# EAGLE board HTH-2019-Badge-PROD-RC1 (EAGLE 9.3.2), part 1 of 2
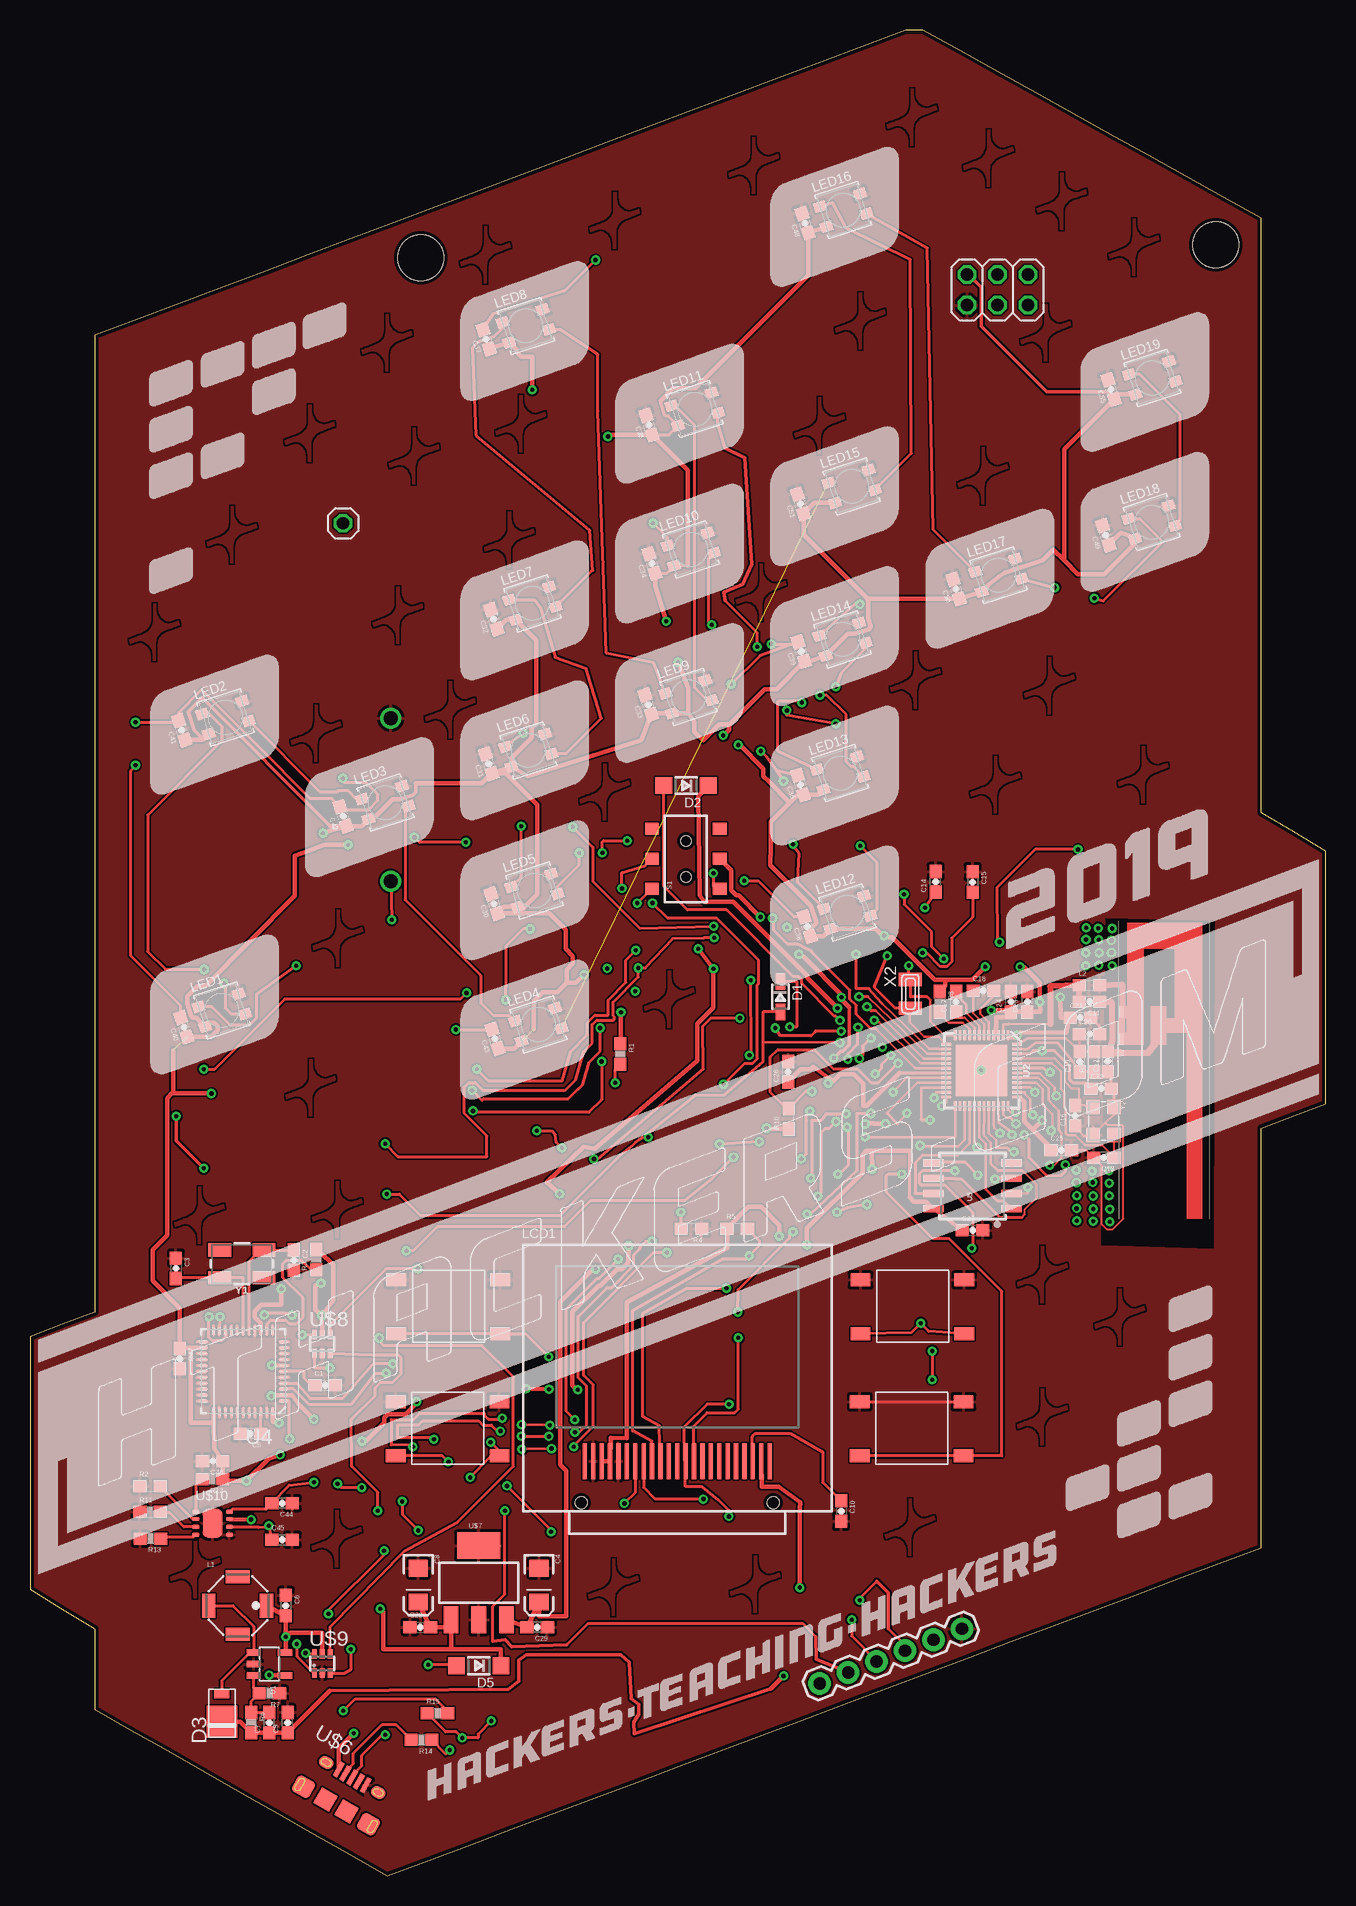
[diagram p2: board, top side]
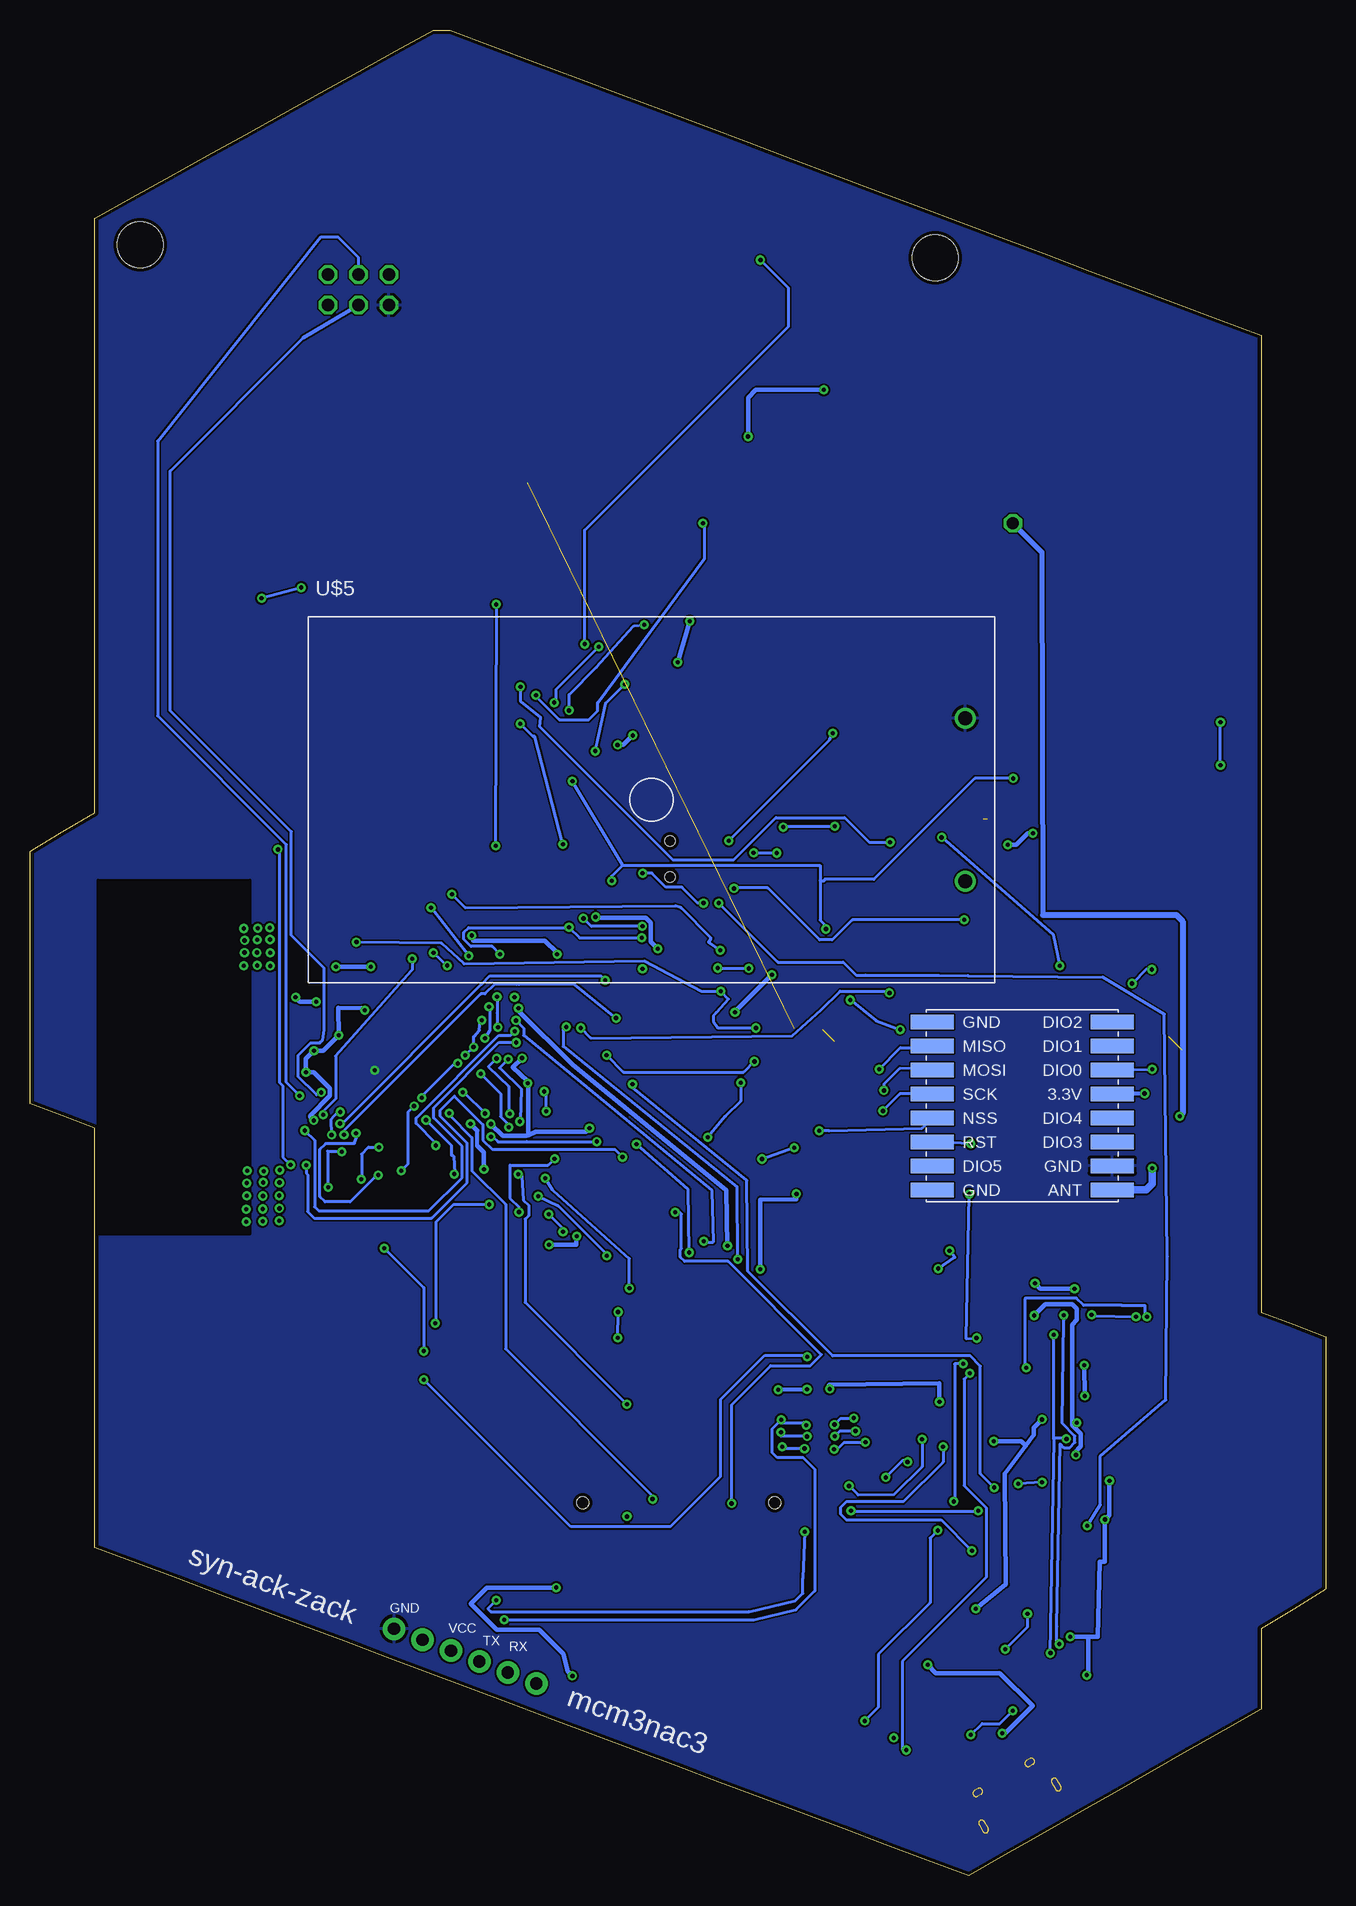
[diagram p3: board, bottom side, seen from below]

Size 108 x 153.82 mm. Coordinates in mm from the lower left corner, seen from the top.
Outline: 108,85.39 105.29,87 102.59,88.6 102.59,138.13 99.46,139.87 96.32,141.62 93.19,143.36 90.06,145.1 86.93,146.85 83.8,148.59 80.66,150.33 77.53,152.07 74.4,153.82 72.99,153.82 69.43,152.48 65.88,151.14 62.32,149.8 58.76,148.46 55.2,147.12 51.65,145.78 48.09,144.44 44.53,143.1 40.98,141.76 37.42,140.43 33.86,139.09 30.31,137.75 26.75,136.41 23.19,135.07 19.64,133.73 16.08,132.39 12.52,131.05 8.97,129.71 5.41,128.37 5.41,46.98 2.7,45.95 0,44.92 0,23.88 2.7,22.23 5.41,20.59 5.41,13.88 8.46,12.14 11.5,10.41 14.55,8.67 17.6,6.94 20.65,5.2 23.69,3.47 26.74,1.73 29.79,0 33.26,1.3 36.72,2.6 40.19,3.91 43.66,5.21 47.12,6.51 50.59,7.81 54.06,9.11 57.52,10.41 60.99,11.72 64.46,13.02 67.92,14.32 71.39,15.62 74.86,16.92 78.32,18.23 81.79,19.53 85.26,20.83 88.72,22.13 92.19,23.43 95.66,24.73 99.12,26.04 102.59,27.34 102.59,62.29 105.29,63.32 108,64.35 108,85.39
Copper layers (1*16): Top 0.035mm / dielectric 1.5mm / Bottom 0.035mm
Design rules "default *": minimum track width 6mil, minimum drill 0.35mm, track to track 6mil, track to pad 6mil, pad to pad 6mil, via to via 6mil, smd to smd 6mil, copper to edge 12mil, drill to drill 8mil, minimum pad ring 10mil, minimum via ring 8mil, stop-mask expansion 4mil, vias tented up to drill 14mil, thermal gap 10mil
Holes 3.81 mm at 98.8,135.92 32.57,134.85

## Footprints (pad centres in the part's own frame; a part is rotated, then mirrored left to right if it is on the bottom)
CAP0603 = smd 1.1 x 1: 1 -0.85,0; 2 0.85,0
EIA3216 = smd 1.4 x 1.6: A 1.4,0; C -1.4,0
SOD-323 = smd 1.35 x 0.8: A 1.27,0; C -1.27,0
SOD-123 = smd 1.4 x 1.4: A 1.85,0; C -1.85,0
DO220AAL = smd 2.667 x 2.54: P$1 -0.7,0 | smd 0.762 x 1.27: P$2 1.65,0
TRACE_ANTENNA_2.4GHZ_25.7MM_TUNED = smd 0.46 x 0.46: ANT 0,0.23 | smd 1 x 0.46: GND -1.18,0.23; GND2 -3.38,0.23
1X06 = drill 1.016 pad 1.88: 1 0,0; 2 2.54,0; 3 5.08,0; 4 7.62,0; 5 10.16,0; 6 12.7,0
1X01 = drill 1.016 octagon: 1 0,0
2X03 = drill 1.016 octagon: 1 -2.54,-1.27; 2 -2.54,1.27; 3 0,-1.27; 4 0,1.27; 5 2.54,-1.27; 6 2.54,1.27
SRU5028 = smd 1.1 x 2: 1 2.4,0; 2 -2.4,0 | smd 2 x 1.1: P$1 0,2.4; P$2 0,-2.4
0603 = smd 1.1 x 1: 1 -0.85,0; 2 0.85,0
UG-9664HDDAG01_WRAPAROUND = smd 0.35 x 3: 1 -7.7,4.138; 2 -7,4.138; 3 -6.3,4.138; 4 -5.6,4.138; 5 -4.9,4.138; 6 -4.2,4.138; 7 -3.5,4.138; 8 -2.8,4.138; 9 -2.1,4.138; 10 -1.4,4.138; 11 -0.7,4.138; 12 0,4.138; 13 0.7,4.138; 14 1.4,4.138; 15 2.1,4.138; 16 2.8,4.138; 17 3.5,4.138; 18 4.2,4.138; 19 4.9,4.138; 20 5.6,4.138; 21 6.3,4.138; 22 7,4.138; 23 7.7,4.138 | hole 1: -8,0.688; 8,0.688
LED3535 = smd 1 x 0.85: 1 -1.75,0.875; 2 -1.75,-0.875; 3 1.75,-0.875; 4 1.75,0.875
RES-0603 = smd 1.1 x 1: 1 -0.85,0; 2 0.85,0
AYZ0202 = smd 1 x 1.15: 1 -2.5,2.825; 2 0,2.825; 3 2.5,2.825; 4 -2.5,-2.825; 5 0,-2.825; 6 2.5,-2.825 | hole 0.85: 1.5,0; -1.5,0
SOT23-5 = smd 0.55 x 1.2: 1 -0.95,-1.3; 2 0,-1.3; 3 0.95,-1.3; 4 0.95,1.3; 5 -0.95,1.3
QFN48-0.4MM = smd 0.8 x 0.23: 1 -2.95,2.2; 2 -2.95,1.8; 3 -2.95,1.4; 4 -2.95,1; 5 -2.95,0.6; 6 -2.95,0.2; 7 -2.95,-0.2; 8 -2.95,-0.6; 9 -2.95,-1; 10 -2.95,-1.4; 11 -2.95,-1.8; 12 -2.95,-2.2; 25 2.95,-2.2; 26 2.95,-1.8; 27 2.95,-1.4; 28 2.95,-1; 29 2.95,-0.6; 30 2.95,-0.2; 31 2.95,0.2; 32 2.95,0.6; 33 2.95,1; 34 2.95,1.4; 35 2.95,1.8; 36 2.95,2.2 | smd 0.23 x 0.8: 13 -2.2,-2.95; 14 -1.8,-2.95; 15 -1.4,-2.95; 16 -1,-2.95; 17 -0.6,-2.95; 18 -0.2,-2.95; 19 0.2,-2.95; 20 0.6,-2.95; 21 1,-2.95; 22 1.4,-2.95; 23 1.8,-2.95; 24 2.2,-2.95; 37 2.2,2.95; 38 1.8,2.95; 39 1.4,2.95; 40 1,2.95; 41 0.6,2.95; 42 0.2,2.95; 43 -0.2,2.95; 44 -0.6,2.95; 45 -1,2.95; 46 -1.4,2.95; 47 -1.8,2.95; 48 -2.2,2.95 | smd 4.3 x 4.3: EP 0,0
QFN-44-NOPAD_1:1-OUTFAKES = smd 0.8 x 0.3: 1 -3.337,2.465; 2 -3.337,1.972; 3 -3.337,1.479; 4 -3.337,0.986; 5 -3.337,0.493; 6 -3.337,0; 7 -3.337,-0.493; 8 -3.337,-0.986; 9 -3.337,-1.479; 10 -3.337,-1.972; 11 -3.337,-2.465; 23 3.337,-2.465; 24 3.337,-1.972; 25 3.337,-1.479; 26 3.337,-0.986; 27 3.337,-0.493; 28 3.337,0; 29 3.337,0.493; 30 3.337,0.986; 31 3.337,1.479; 32 3.337,1.972; 33 3.337,2.465 | smd 0.3 x 0.8: 12 -2.465,-3.337; 13 -1.972,-3.337; 14 -1.479,-3.337; 15 -0.986,-3.337; 16 -0.493,-3.337; 17 0,-3.337; 18 0.493,-3.337; 19 0.986,-3.337; 20 1.479,-3.337; 21 1.972,-3.337; 22 2.465,-3.337; 34 2.465,3.337; 35 1.972,3.337; 36 1.479,3.337; 37 0.986,3.337; 38 0.493,3.337; 39 0,3.337; 40 -0.493,3.337; 41 -0.986,3.337; 42 -1.479,3.337; 43 -1.972,3.337; 44 -2.465,3.337
SOIC-8 = smd 0.61 x 1.702: 1 -1.905,-3.251; 2 -0.635,-3.251; 3 0.635,-3.251; 4 1.905,-3.251; 5 1.905,3.251; 6 0.635,3.251; 7 -0.635,3.251; 8 -1.905,3.251
BUTTON = smd 1.65 x 1.1: 1 -4.325,2.25; 2 4.325,2.25; 3 -4.325,-2.25; 4 4.325,-2.25
AA = drill 1.17: + 26.16,-6.795; - 26.16,6.795
USB-MICRO-TH-SUPPORT = smd 0.4 x 1.35: 1 -1.3,2.7; 2 -0.65,2.7; 3 0,2.7; 4 0.65,2.7; 5 1.3,2.7 | smd 1.25 x 0.95: P$1 2.5,2.7; P$2 -2.5,2.7 | smd 1.5 x 1.5: P$3 -1,0; P$4 1,0 | smd 1.645 x 1.55: P$5 3.123,0; P$6 -3.123,0
SOT223 = smd 1.219 x 2.235: 1 -2.311,-3.099; 2 0,-3.099; 3 2.311,-3.099 | smd 3.6 x 2.2: 4 0,3.099
SOT-363 = smd 0.4 x 0.8: 1 -0.65,-0.8; 2 0,-0.8; 3 0.65,-0.8; 4 0.65,0.8; 5 0,0.8; 6 -0.65,0.8
8-VDFN = smd 0.6 x 0.3: 1 -1.4,0.95; 2 -1.4,0.35; 3 -1.4,-0.3; 4 -1.4,-0.95; 5 1.4,-0.95; 6 1.4,-0.3; 7 1.4,0.35; 8 1.4,0.95 | smd 1.65 x 2.4: 9 0,0
WIRELESS-LORA-RFM95W#SMD = smd 3.6 x 1.2: A1 -7.5,7; A2 -7.5,5; A3 -7.5,3; A4 -7.5,1; A5 -7.5,-1; A6 -7.5,-3; A7 -7.5,-5; A8 -7.5,-7; B1 7.5,7; B2 7.5,5; B3 7.5,3; B4 7.5,1; B5 7.5,-1; B6 7.5,-3; B7 7.5,-5; B8 7.5,-7
XTAL3215 = smd 1.1 x 1.9: P$1 1.2,0; P$2 -1.2,0
CRYSTAL-SMD-5X3.2-4PAD = smd 1.9 x 1.1: 1 -1.85,-1.15; 2 1.85,-1.15; 3 1.85,1.15; 4 -1.85,1.15
CRYSTAL-SMD-3.2X2.5 = smd 1.2 x 1.1: 1 -1.175,-0.875; 2 1.175,-0.875; 3 1.175,0.875; 4 -1.175,0.875

## Placement (x,y rotation side)
C1  1uF  [CAP0603]  24.59,40.88 0 top
C2  22pF  [CAP0603]  21.99,51.3 270 top
C3  22pF  [CAP0603]  12.16,50.62 270 top
C4  10uF  [EIA3216]  42.42,24.22 270 top
C5  0.1uF  [CAP0603]  18.37,36.85 180 top
C6  10uF  [CAP0603]  21.32,22.52 270 top
C7  0.1uF  [CAP0603]  19.95,12.77 90 top
C8  10uF  [EIA3216]  32.37,24.22 270 top
C9  10uF  [CAP0603]  21.47,12.77 90 top
C10  10uF  [CAP0603]  67.6,30.39 270 top
C11  5.6pF  [CAP0603]  88.3,72.84 180 top
C12  2.4pF  [CAP0603]  89.82,67.86 90 top
C13  10pF  [CAP0603]  89.49,59.86 180 top
C14  15pF  [CAP0603]  75.47,82.84 90 top
C15  15pF  [CAP0603]  78.54,82.81 270 top
C16  10pF  [CAP0603]  87.09,63.35 90 top
C17  270pF  [CAP0603]  77.17,72.84 90 top
C18  270pF  [CAP0603]  79.46,73.75 0 top
C19  3nF  [CAP0603]  87.49,67.84 90 top
C20  10nF  [CAP0603]  88.3,70.14 0 top
C21  0.1uF  [CAP0603]  87.54,71.52 0 top
C22  100pF  [CAP0603]  89.27,65.6 0 top
C23  0.1uF  [CAP0603]  83.12,72.84 90 top
C24  10uF  [CAP0603]  81.74,72.84 90 top
C25  0.1uF  [CAP0603]  85.93,60.47 0 top
C26  0.1uF  [CAP0603]  63.17,67.01 90 top
C27  0.1uF  [CAP0603]  78.54,53.79 0 top
C28  0.1uF  [CAP0603]  32.52,20.72 0 top
C29  1uF  [CAP0603]  42.27,20.72 180 top
C30  0.1uF  [CAP0603]  38.68,81 108 top
C31  0.1uF  [CAP0603]  38.23,92.67 108 top
C32  0.1uF  [CAP0603]  38.65,104.71 108 top
C33  0.1uF  [CAP0603]  51.52,97.59 108 top
C34  0.1uF  [CAP0603]  51.83,109.35 108 top
C35  0.1uF  [CAP0603]  51.59,120.89 108 top
C36  0.1uF  [CAP0603]  64.21,90.89 108 top
C37  0.1uF  [CAP0603]  38.01,128.05 108 top
C38  0.1uF  [CAP0603]  64.76,79.1 108 top
C39  0.1uF  [CAP0603]  64.27,102.02 108 top
C40  0.1uF  [CAP0603]  12.82,70.72 108 top
C41  0.1uF  [CAP0603]  12.64,95.46 108 top
C42  0.1uF  [CAP0603]  26.1,88.29 108 top
C43  0.1uF  [CAP0603]  38.76,69.74 108 top
C44  1uF  [CAP0603]  21.01,31.05 180 top
C45  1uF  [CAP0603]  21.01,28.01 0 top
C46  4.7uF  [CAP0603]  15.22,34.56 180 top
C47  1uF  [CAP0603]  12.48,43.09 270 top
C48  0.1uF  [CAP0603]  64.59,137.72 108 top
C49  0.1uF  [CAP0603]  89.64,111.72 108 top
C50  0.1uF  [CAP0603]  77.18,107.23 108 top
C51  0.1uF  [CAP0603]  64.2,114.31 108 top
C55  0.1uF  [CAP0603]  90.1,123.86 108 top
D1  1N4148  [SOD-323]  62.53,73.26 270 top
D2  MBR120  [SOD-123]  54.67,90.86 180 top
D3  SS1P3L  [DO220AAL]  15.98,13.53 90 top
D5  MBR120  [SOD-123]  37.4,17.52 180 top
E1  ANTENNA  [TRACE_ANTENNA_2.4GHZ_25.7MM_TUNED]  90.74,68.57 270 top
FTDI  FTDI Basic  [1X06]  65.81,16.03 21 top
JP1  [1X01]  26.09,112.71 0 top
JP2  [2X03]  80.62,132.17 0 top
L1  10uH/1.8A  [SRU5028]  17.3,22.52 0 top
L2  2.7nH  [0603]  88.3,74.21 0 top
LCD1  UG-9664HDDAG01  [UG-9664HDDAG01_WRAPAROUND]  53.94,30.4 0 top
LED1  WS2812B3535  [LED3535]  15.99,72.12 18 top
LED2  WS2812B3535  [LED3535]  16.29,96.53 18 top
LED3  WS2812B3535  [LED3535]  29.61,89.43 18 top
LED4  WS2812B3535  [LED3535]  42.36,70.94 18 top
LED5  WS2812B3535  [LED3535]  42.04,82.11 18 top
LED6  WS2812B3535  [LED3535]  41.53,93.78 18 top
LED7  WS2812B3535  [LED3535]  41.87,106.04 18 top
LED8  WS2812B3535  [LED3535]  41.32,129.16 18 top
LED9  WS2812B3535  [LED3535]  54.88,98.25 18 top
LED10  WS2812B3535  [LED3535]  55.07,110.54 18 top
LED11  WS2812B3535  [LED3535]  55.4,122.21 18 top
LED12  WS2812B3535  [LED3535]  68.11,80.28 18 top
LED13  WS2812B3535  [LED3535]  67.52,91.89 18 top
LED14  WS2812B3535  [LED3535]  67.71,103.04 18 top
LED15  WS2812B3535  [LED3535]  68.47,115.79 18 top
LED16  WS2812B3535  [LED3535]  67.77,138.81 18 top
LED17  WS2812B3535  [LED3535]  80.7,108.38 18 top
LED18  WS2812B3535  [LED3535]  93.48,112.8 18 top
LED19  WS2812B3535  [LED3535]  93.53,124.82 18 top
R1  10k  [RES-0603]  49.19,68.49 270 top
R2  100k  [RES-0603]  10.01,32.48 0 top
R3  10k  [RES-0603]  23.86,51.34 90 top
R4  920k  [RES-0603]  55.12,53.91 180 top
R5  10k  [RES-0603]  58.93,53.94 0 top
R6  100K  [RES-0603]  18.42,12.77 270 top
R7  10K  [RES-0603]  19.95,15.2 180 top
R8  10k  [RES-0603]  75.8,72.84 270 top
R9  20k  [RES-0603]  88.67,67.83 90 top
R10  10k  [RES-0603]  63.22,63.09 90 top
R11  20k  [RES-0603]  10.01,30.32 0 top
R12  100k  [RES-0603]  15.22,33.04 180 top
R13  1k  [RES-0603]  10.04,28.11 180 top
R14  22  [RES-0603]  32.63,11.32 180 top
R15  22  [RES-0603]  33.95,13.53 0 top
S1  SWITCH-DPDTSMD  [AYZ0202]  54.66,84.74 90 top
U1  FAN5331SX  [SOT23-5]  19.95,17.64 270 top
U2  ESP3212  [QFN48-0.4MM]  79.31,67.1 270 top
U4  ATMEGA32U4  [QFN-44-NOPAD_1:1-OUTFAKES]  17.76,42.03 180 top
U5  W25Q32FVSS  [SOIC-8]  78.54,57.5 90 top
U$1  BUTTON  [BUTTON]  34.79,37.25 0 top
U$2  BUTTON  [BUTTON]  34.85,47.42 0 top
U$3  BUTTON  [BUTTON]  73.54,47.41 0 top
U$4  BUTTON  [BUTTON]  73.47,37.25 0 top
U$5  BAT_HOLD  [AA]  56.21,89.67 0 bottom
U$6  USB_SENSE  [USB-MICRO-TH-SUPPORT]  25.5,5.86 330 top
U$7  V_REG_MIC2920  [SOT223]  37.4,24.42 0 top
U$8  74LVC1G3157GW,125  [SOT-363]  24.37,44.31 0 top
U$9  74LVC1G3157GW,125  [SOT-363]  24.37,17.69 0 top
U$10  TPS2113ADRBR3X3MM  [8-VDFN]  15.22,29.38 0 top
U$11  WIRELESS-LORA-RFM95W#SMD  [WIRELESS-LORA-RFM95W#SMD]  25.31,64.15 0 bottom
X2  32.768  [XTAL3215]  73.36,73.5 270 top
Y1  8MHz  [CRYSTAL-SMD-5X3.2-4PAD]  17.65,51 180 top
Y2  26MHz  [CRYSTAL-SMD-3.2X2.5]  89.47,62.9 270 top

## Tracks (layer width: path | path; a pad name or v marks a point on that pad's centre or on a via)
3V3  (via drill 0.35)
  Top 0.356: U$7.3 C29.2 C4.A 42.42,21.64 44.68,21.64 44.68,33.77 44.19,34.27 44.19,47.84 46.89,50.54 v47.14,50.54 | S1.5 58.44,83.78 58.44,82.12 58.85,81.7 59.06,81.7 v60.87,79.9 | v55.68,77.25 v56.96,75.58 56.96,72.34 55.61,71 55.61,70.99 55.61,70.98 55.61,70.8 55.61,67.92 47.06,60.58 46.16,60.74 43.07,57.78 v44.13,56.82
  Bottom 0.356: v47.14,50.54 47.14,56.34 44.13,56.4 v44.13,56.82 | v60.87,79.9 60.8,79.83 56.67,79.83 56.25,79.41 56.25,77.82 v55.68,77.25
3V3_IN_REG  (via drill 0.35)
  Top 0.254: U$10.8 16.84,30.54 19.65,30.54 C44.2 21.6,32.55 v23.66,32.79 | v27.64,32.35 25.95,32.35 v25.63,32.67 | v51.87,81.06 53.16,79.78 57.23,79.78 60.72,76.29 60.72,74.35 60.61,74.24 60.61,68.09 60.22,67.71 59.55,67.71 v57.79,65.95 | v56.95,83.55 56.95,82.46 S1.4
  Bottom 0.254: v27.64,32.35 28.79,33.51 28.79,42.47 29.64,43.32 41.12,43.32 48.2,50.4 48.27,57.95 57.79,65.7 v57.79,65.95 | v23.66,32.79 v25.63,32.67 | v51.87,81.06 52.36,81.06 53.68,82.38 55.01,82.38 56.18,83.55 v56.95,83.55
3V3_OUT  (via drill 0.35)  (3 unrouted)
  Top 0.229: 83.33,68.49 U2.46
  Top 0.254: C22.1 87.97,66.05 86.97,66.05 86.66,66.35 86.66,67.47 85.37,68.76 v84.33,68.76 83.59,68.76 83.33,68.49 | 73.32,56.53 73.32,60.41 | U2.43 82.39,67.3 82.39,67.29 84.47,67.29 84.79,66.97 | U2.46 | 72.48,66.91 73.61,66.91 73.62,66.9 73.63,66.9 U2.19 | 52.55,122.93 52.55,122.75 52.88,121.71 52.95,121.65 53.2,121.65 LED11.2 53.24,120.08 C35.1 | C34.1 53.05,108.55 LED10.2 54.82,109.17 | U2.1 81.65,69.9 | U2.37 82.34,64.9 82.59,64.66 82.7,64.66 | 80.48,70.22 U2.4 U2.3
  Top 0.305: v66.99,68.14 67.57,68.72 67.73,68.72 68.28,69.27 68.28,72.39 | JP2.2 78.19,133.44 79.25,132.37 79.25,129.14 84.73,123.66 89.75,123.66 C55.1 | 32.14,91.03 32.14,90.31 31.89,90.06 30.82,89.71 | 25.03,87.48 14.35,98.15 13.19,96.99 13.68,95.48 14.31,94.85
  Top 0.355: 80.48,70.22 80.48,70.65
  Top 0.356: U1.4 v19.95,16.73 | v21.32,19.93 21.32,18.66 U1.5 | v21.32,19.93 C6.2 L1.1 | 15.32,37.76 15.37,35.63 C46.1 R12.1 16.2,32.91 v18.04,32.91 19.88,34.75 v20.84,35.07 | 15.32,37.76 U4.34 | 13.39,44.01 13.24,44.01 C47.1 12.48,47.31 10.22,49.57 10.22,52.16 11.44,53.38 11.44,64.81 11.82,65.19 11.94,65.19 | 13.39,44.01 13.85,44.01 U4.24 | 13.39,44.01 13.39,37.76 15.32,37.76 | v21.32,19.93 21.63,20.25 24.36,20.25 U$9.5 | U$10.7 v18.42,29.68 | v20.76,37.76 20.47,37.76 20.25,37.85 20.23,38.56 U4.44 | U4.14 19.24,46.05 18.73,46.55 18.73,47.06 19.28,47.61 20.89,47.61 20.95,47.67 v20.95,48.93 | C27.1 U5.8 75.23,55.59 74.63,56.19 73.67,56.19 73.32,56.53 | 80.48,70.65 80.51,70.68 80.51,71.55 82.04,71.56 81.61,71.99 | 81.56,71.99 81.61,71.99 | 81.61,71.99 C24.1 C23.1 84.17,72 v84.15,72.83 84.15,74.42 84.15,74.44 82.83,75.75 v82.5,75.75 | 81.56,71.99 81.59,71.96 | 81.56,71.99 81.42,72.12 v80.11,72.12 | C21.1 86.62,71.52 | 86.62,71.52 86.59,71.51 85.88,71.5 v85.87,73.21 | R8.1 75.8,73.73 76.25,74.19 76.25,74.52 76.42,74.69 | 76.42,74.69 75.39,74.69 71.87,78.21 71.33,78.21 v71.18,78.35 71.06,78.35 70.5,78.91 LED12.2 66.1,78.29 C38.1 65.03,78.92 65.5,79.4 65.5,79.51 65.08,80.82 61.7,84.2 61.7,85.01 61.72,85.01 61.72,87.85 63.31,89.43 | C25.1 85.08,60.65 83.55,62.18 | 83.55,62.18 82.86,62.87 82.86,64.5 82.7,64.66 | 84.79,66.97 v85,66.97 | v84.35,62.95 83.57,62.16 83.55,62.18 | v64.74,52.59 64.74,53.94 69.4,58.6 69.4,60.11 69.7,60.41 70.13,60.41 | 70.13,60.41 73.32,60.41 | 11.96,68.78 11.94,68.8 11.94,65.19 | 28.56,88.05 30.22,89.71 30.82,89.71 | C31.1 37.66,91.03 32.14,91.03 | 44.72,74.41 44.72,75.52 45.22,76.03 45.22,76.65 44.64,77.23 44.64,78.83 43.27,80.2 C30.1 39.48,80.74 LED5.2 41.23,80.74 42.28,81.79 42.28,89.24 39.66,91.86 C31.1
  Top 0.356: v46.17,75.09 45.49,74.41 44.72,74.41 | C31.1 LED6.2 | C32.1 39.68,104.67 LED7.2 42.17,102.98 42.17,96 41.82,95.65 41.82,94.84 40.14,93.16 LED6.2 | C37.1 LED8.2 40.55,127.16 40.55,126.95 40.92,126.58 41.85,126.58 v41.85,123.83 | v48.16,119.94 48.23,120.08 C35.1 54.82,117.11 54.82,109.17 | C34.1 52.09,107.49 v53.01,104.56 | LED13.2 65.69,90.09 C36.1 63.96,90.09 63.31,89.43 | 69.81,106.42 C50.1 77.46,106.42 LED17.2 79.98,107.68 80.74,108.24 81.22,108.6 84.38,109.64 85.27,110.52 86.17,109.62 | 69.81,106.42 64.46,111.77 C51.1 65.37,114.41 LED15.2 | LED16.2 C48.1 64.85,133.38 55.42,123.95 53.57,123.95 52.55,122.93 | LED19.2 90.75,123.45 C55.1 86.17,118.86 86.17,109.62 | 86.17,109.62 87.3,108.48 89.52,108.48 92.08,111.04 LED18.2 92.08,111.51 91.97,111.55 90.91,111.92 C49.1 | 68.28,72.39 67.62,73.04 v67.62,73.22 67.62,73.42 64.67,76.38 64.24,76.8 v64.08,76.8 | v71.29,62.68 70.31,62.68 70.26,62.73 69.66,62.73 v69.59,62.65 | v70.17,58.87 70.13,60.41 | C26.1 64.24,67.22 65.08,67.22 65.28,67.43 66.53,66.5 66.55,66.52 66.7,66.4 66.81,66.32 | 66.81,66.32 66.95,66.22 67.5,66.78 68.65,66.78 69.44,65.99 69.44,64.17 69.74,64.17 72.48,66.91 | 66.81,66.32 66.79,66.32 v66.51,66.04 | 86.62,71.52 86.35,70.27 82.53,70.3 v82.28,70.05 82.13,69.9 81.65,69.9 | 54.84,96.88 LED9.2 51.87,96.88 C33.1 50.92,94.64 41.49,91.63 LED6.2 | 54.84,96.88 54.84,98.97 v54.03,101.13 | 58.26,95.97 57.43,95.97 56.08,94.62 55.35,95.35 55.35,96.19 54.84,96.88 | 58.26,95.97 58.32,95.97 61.25,98.89 62.22,98.89 C39.1 64.86,101.17 LED14.2 68.14,103.5 68.73,103.5 69.94,103.89 70.06,104.14 69.85,104.8 69.85,106.24 69.81,106.28 69.81,106.42
  Top 0.356: v61.37,62.3 61.44,62.24 R10.1 | v24.31,46.69 23.76,47.16 23.76,49.19 v24.25,49.37 | R3.2 25.28,50.97 25.27,47.93 v24.31,46.69 | U$8.5 v24.31,46.69 | R1.1 49.25,69.4 v49.25,71.96 | LCD1.3 LCD1.4 48.39,36.49 49.74,36.47 49.74,47.78 58.08,52.34 R5.1 59.87,55.74 60.94,55.74 62.45,54.23 v62.45,53.29 | v59.03,94.24 59.13,94.24 61.11,92.26 61.11,91.65 61.56,91.2 63.31,89.43 | v57.77,95.03 58.26,95.51 58.26,95.97 | v15.12,65.19 11.94,65.19 | 44.72,74.41 43.93,73.62 42.73,73.62 41.97,72.86 41.97,70.57 | v79.61,75.75 78.54,74.69 76.42,74.69 | C41.1 14.39,94.65 LED2.2 14.59,94.85 14.31,94.85 | C40.1 15.08,69.91 15.65,70.48 15.65,70.78 15.35,71.08 14.93,71.08 LED1.2 13.85,71.5 13.57,71.5 13.44,71.62 13.09,72.69 13.11,72.73 13.11,73.29 13.94,74.11 14.6,74.11 22.07,81.69 22.07,85 23.71,85.57 23.75,85.61 24.58,85.91 v26.51,85.91 | C42.1 25.03,87.48 | LED3.2 27.64,87.48 C42.1 | LED4.2 40.34,68.94 C43.1 | C42.1 24.57,86.97 v24.42,86.88
  Bottom 0.33: 70.71,60.84 70.71,62.09
  Bottom 0.356: 19.79,19.93 19.79,16.88 v19.95,16.73 | 19.79,19.93 19.04,19.93 18.84,26.18 18.42,26.18 v18.42,29.68 18.04,30.07 v18.04,32.91 | v24.31,46.69 23.39,47.61 21.13,47.61 20.76,47.24 20.76,46.32 21.16,45.91 21.16,37.78 | 19.79,19.93 v21.32,19.93 | 21.16,37.78 21.16,37.55 20.43,36.82 20.43,35.79 21,35.23 v20.84,35.07 | 21.16,37.78 20.79,37.78 v20.76,37.76 | v24.25,49.37 23.81,48.93 v20.95,48.93 | v82.28,70.05 82.3,72.33 80.16,72.3 80.01,72.22 v80.11,72.12 | v85.87,73.21 85.53,72.86 v84.15,72.83 | v84.35,62.95 84.65,63.24 84.65,63.35 83.01,64.99 83.01,65.64 84.34,66.97 v85,66.97 85,68.09 v84.33,68.76 83.58,68.75 v82.28,70.05 | v64.74,52.59 62.49,52.59 v62.45,53.29 | v49.25,71.96 49.25,72.02 v46.17,75.09 | v48.16,119.94 48.16,123.17 47.51,123.83 v41.85,123.83 | v71.18,78.35 71.06,78.35 71.06,77.91 65.11,77.94 64.08,76.93 v64.08,76.8 | v66.99,68.14 67.77,67.36 66.51,66.23 v66.51,66.04 66.46,66 66.46,61.73 | v69.59,62.65 68.6,61.66 66.63,61.66 66.62,61.65 66.49,61.71 66.46,61.73 | 66.46,61.73 65.84,62.02 61.66,62.02 v61.37,62.3 | U$11.B4 v15.12,65.19 | v82.28,70.05 | v59.03,94.24 58.57,94.24 v57.78,95.03 v57.77,95.03 | v70.17,58.87 70.17,60.3 70.71,60.84 | 70.71,62.09 v71.29,62.68 | v53.01,104.56 v54.03,101.13 | v82.5,75.75 v79.61,75.75 | v26.51,85.91 25.81,85.91 24.85,86.88 v24.42,86.88
3V_IN_BATT  (via drill 0.35)
  Top 0.254: U$10.6 16.67,29.03 19.06,29.03 19.8,29.08 v19.89,29.16 C45.1 | S1.1 v50.6,81.06
  Bottom 0.254: v19.89,29.16 18.8,30.9 18.8,34.97 13.34,39.66 13.21,51.6 13.47,71.8 18.62,74.89 29.85,75.02 29.82,75 32.27,75.03 38.36,75.05 39.16,75.05 40.25,76.14 45.68,76.14 v50.6,81.06
5V  (via drill 0.35)
  Top 0.356: 35.11,18.89 35.09,20.72 | 35.09,20.72 U$7.1 35.11,18.89 | 35.09,20.72 C28.2 C8.A | v23.66,38.03 22.36,39.33 21.84,40.05 U4.2 20.53,40.06 20.15,40.03 v20.1,39.99 | U4.7 v20.15,42.54 | v43.25,40.56 v41.36,40.57 | v45.64,40.5 45.58,40.5 45.2,40.89 45.2,46.98 47.38,49.16 47.53,49.16 48.92,50.55 49.31,50.55 49.86,51.1 49.86,51.93 49.87,51.94 v49.87,52.51 | D2.C 56.35,90.68 55.68,89.95 55.81,81.7 56.19,81.16 57.94,81.16 58.6,81.16 64.75,75.01 64.75,74.84 v67.29,72.3 | 35.11,18.89 39.22,18.89 39.23,18.39 39.23,18.22 D5.C | v29.19,22.27 29.44,22.01 29.44,18.89 35.11,18.89 | v27.68,36.22 27.97,36.22 29.51,37.75 29.51,38.18 29.8,38.47 31.29,38.47 32.21,39.38 v32.21,39.49
  Bottom 0.356: v23.66,38.03 24.36,37.33 24.36,36.74 25.03,35.85 | v20.15,42.54 v20.1,39.99 | v41.36,40.57 v41.36,40.58 41.38,40.92 32.21,41.04 v32.21,39.49 | v45.64,40.5 45.38,40.5 v43.25,40.56 | v49.87,52.51 v49.88,52.51 49.97,57.14 62.77,67.58 67.29,72.1 v67.29,72.3 | 25.03,35.85 26.78,33.49 26.67,24.28 v29.19,22.27 | v27.68,36.22 25.4,36.22 25.03,35.85
12V  (via drill 0.35)
  Top 0.305: 61.73,15.59 50.37,11.82 50.3,12.79 50.73,13.45 50.73,14.31 50.12,14.77 49.94,17.79 49.23,18.43 41.36,18.4 40.75,17.97 40.75,16.22 39.86,15.56 24.99,15.43
  Top 0.356: D3.P$1 17.51,12.83 R6.2 C7.1 C9.1 24.99,15.43 | v62.8,16.66 61.73,15.59 | v64.14,24.02 64.14,30.58 64.19,31.14 62.41,32.43 60.97,32.43 LCD1.22
  Bottom 0.356: v62.8,16.66 63.2,17.06 63.57,18.52 65.55,20.5 69.1,20.5 71.27,22.67 69.92,24.02 v64.14,24.02
ATMEGA_RX  (via drill 0.35)
  Top 0.254: v14.92,46.6 14.86,46.54 14.86,44.93 15.18,44.6 15.98,44.6 16.3,44.92 16.3,45.35 U4.20 | v24.97,42.33 24.94,42.3 23.71,42.3 23.71,42.32 U$8.1
  Bottom 0.254: v24.97,42.33 25.1,42.46 25.1,48.07 25.04,48.13 20.81,48.13 20.2,47.53 17.04,47.53 17.03,47.52 15.07,47.52 15.07,46.75 v14.92,46.6
ATMEGA_TX  (via drill 0.35)
  Top 0.254: v22.23,19.32 22.27,19.28 22.27,18.26 23.64,16.89 U$9.1 | v15.83,46.6 U4.21 | v19.53,46.76 19.5,46.76 19.65,46.89 21.23,46.87 21.67,46.87 v21.84,46.71
  Bottom 0.254: v22.23,19.32 22.45,19.54 22.45,20.74 22.42,20.77 22.19,33.96 22.16,35.99 21.85,35.68 21.35,35.68 20.92,36.11 20.92,36.64 21.97,37.7 21.85,46.3 21.78,46.79 v21.84,46.71 | v19.53,46.76 19.32,46.65 19.3,46.67 v15.83,46.6
CS  (via drill 0.35)
  Top 0.229: U2.21 76.39,66.1 76.4,66.09 75.06,66.09 75.05,66.1 73.95,66.1 71.43,63.57 | 72.28,62.66 73.07,63.45 v73.07,63.55
  Top 0.254: v56.12,31.39 52.12,31.39 51.14,32.38 LCD1.8 | 71.43,63.57 71.43,63.54 72.28,62.66
  Bottom 0.254: v73.07,63.55 73.07,63.42 71.17,61.52 71.17,58.74 68.37,55.94 68.37,43.9 56.12,31.65 v56.12,31.39
D+  (via drill 0.35)
  Top 0.254: R15.1 34.63,12 35.51,12 35.51,11.99 v36.01,11.49 37.34,11.49 37.34,11.8 v38.45,12.91 | U4.4 22.21,41.06 23.35,39.79 26.04,39.79 28.62,42.69 v30.23,42.66 | v31.03,31.2 31.03,30.11 v32.36,28.78
  Bottom 0.254: v30.23,42.66 30.94,42.66 30.94,31.28 v31.03,31.2 | v32.36,28.78 32.99,28.14 32.99,22.76 37.3,18.46 37.3,14.05 v38.45,12.91
D-  (via drill 0.35)
  Top 0.254: v34.99,10.48 34.65,10.15 R14.1 | v29.68,41.88 28.76,41.88 26.75,39.29 23.25,39.29 21.96,40.58 21.13,40.58 U4.3
  Bottom 0.254: v29.68,41.88 30.15,41.39 30.15,32.51 28.31,30.67 28.31,24.86 35.3,17.88 35.3,10.48 v34.99,10.48
DC  (via drill 0.35)
  Top 0.229: U2.16 74.47,68.09 70.49,72.07
  Top 0.254: 70.49,72.07 70.1,72.07 v69.75,72.42 | v70.09,69.81 70.1,69.86 69.38,69.14 69.38,68.37 v69.12,68.11 | v65.06,58.14 65.17,58.25 65.17,62.98 65.96,62.98 66.37,63.52 v68.03,63.52 | LCD1.10 52.46,37.51 51.06,38.26 51.06,46.85 54.75,48.97 v58.04,48.97
  Bottom 0.254: v58.04,48.97 58.04,51.42 64.44,57.13 v65.06,58.14 | v69.75,72.42 69.68,72.35 69.68,70.42 70.09,69.75 v70.09,69.81 | v69.12,68.11 69.79,67.44 68.1,65.79 68.1,63.59 v68.03,63.52
ESP_RX  (via drill 0.35)
  Top 0.178: v85.09,62.11 85.17,62.18 85.17,63.5 85.16,63.5
  Top 0.229: 85.16,63.5 84.4,64.26 84.4,65.55 83.86,66.1 82.34,66.1 U2.40
  Top 0.254: U$9.4 25.01,20.73 31.21,27.08 35.61,29.45 40.27,34.11 40.27,41.57 37.65,44.19 29.47,44.19 29.12,44.54 v29.12,44.82 | v29.72,56.81 30.79,56.81 32.58,55.02 44.15,55 49.12,59.97 50.16,60.81 50.43,61.08 50.77,61.35 51.03,61.55 v51.51,61.55 51.51,61.88 51.65,62.02 55.43,65.06 57.9,65.1 61.09,67.82 61.09,69.42 | 61.09,69.42 61.09,71.99 D1.A | v67.47,69.44 61.09,69.42 | v48.77,66.08 48.75,67.2 R1.2
  Bottom 0.254: v29.72,56.81 30,44.77 v29.12,44.82 | v85.09,62.11 84.27,61.28 84.27,55.74 83.96,55.42 74.75,55.42 71.99,58.19 71.99,60.79 74.36,63.16 74.36,64 68.92,69.44 v67.47,69.44 | v48.77,66.08 48.77,64.56 50.04,63.29 v51.51,61.55
ESP_TX  (via drill 0.35)
  Top 0.178: 85.81,62.08 85.96,61.93 85.96,59.82 85.35,59.22 v84.98,59.22
  Top 0.2: 85.81,62.08 85.72,62.16 85.72,63.77 85.31,64.19
  Top 0.229: U2.41 84,66.5 84.89,65.61 84.89,64.61 85.31,64.19 | U2.41
  Top 0.254: v32.31,50.6 29.68,50.6 25.01,45.94 U$8.4 | v31.37,52.09 v31.37,52.1 31.96,52.1 33.94,54.09 44.52,54.09 46.7,56.26 54.53,56.26 56.86,58.13 v58.62,59.9
  Bottom 0.254: v32.31,50.6 30.92,51.54 v31.37,52.09 | v84.98,59.22 84.98,58.55 84.86,58.44 84.86,55.36 84.32,54.81 74.53,54.81 71.58,57.77 71.58,61.06 73.83,63.31 73.83,63.79 72.63,64.98 70.25,62.61 70.25,61.31 69.47,60.53 59.26,60.53 v58.62,59.9
FLASH_SCK
  Top 0.178: 82.67,54.87 82.91,55.12 82.91,55.54 83.88,56.51 83.88,57.58 82.73,58.74
  Top 0.229: U2.31 79.51,63.25 79.51,63.24 79.51,62.99 79.49,62.36 79.49,61.69 80.08,61.1 80.08,59.34
  Top 0.254: U5.6 75.32,58.1 77.09,58.08 77.6,58.08 80.81,54.87 82.67,54.87 | 82.73,58.74 80.68,58.74 80.08,59.34
FLASH_SCS
  Top 0.229: U2.30 79.11,63.22 79.09,63.2 79.11,61.53 79.66,60.98 79.66,57.22
  Top 0.254: U5.1 81.12,56.27 80.61,56.27 79.66,57.22
FLASH_SDI  (via drill 0.35)
  Top 0.229: U2.33 80.31,62.51 80.37,62.34 v80.83,61.88
  Top 0.254: v78.98,58.39 77.93,59.45 75.34,59.45 U5.5
  Bottom 0.254: v78.98,58.39 79.09,58.39 81.32,56.16 83.41,56.16 83.84,56.59 83.84,60.53 83.36,61.01 80.97,61.01 80.8,61.46 v80.83,61.88
FLASH_SDO  (via drill 0.35)
  Top 0.178: v83.15,57.38 83.14,56.86 U5.2 | v82.01,60.33 81.88,60.33 81.82,60.27
  Top 0.229: U2.32 79.92,63.05 79.92,61.87 80.5,61.28 80.5,60.66 81.42,60.66
  Top 0.254: 81.82,60.27 81.42,60.66
  Bottom 0.254: v83.15,57.38 83.2,57.43 83.2,60.39 82.05,60.38 v82.01,60.33
FLASH_SHD
  Top 0.229: U2.28 78.31,64.06 78.3,64.06 78.3,61.03 77.33,60.06 74.39,60.06
  Top 0.254: 74.39,60.06 73.75,59.42 73.75,56.86 U5.7
FLASH_SWP  (via drill 0.35)
  Top 0.178: U5.3 81.78,58.12
  Top 0.229: v78.92,60.72 78.7,60.94 78.7,64.13 U2.29
  Top 0.254: 81.78,58.12 80.48,58.12 v80.4,58.04
  Bottom 0.254: v80.4,58.04 80.37,58.06 80.37,58.2 80.37,60.15 79.8,60.72 v78.92,60.72
FTDI_RX  (via drill 0.35)
  Top 0.254: U$8.3 28.6,43.38 30.71,43.38 30.93,43.16 30.93,41.84 30.22,41.12 29.23,41.12 28.75,40.65 28.75,40 26.79,38.04 26.81,34.12 28.99,31.94 v28.99,30.42 | 38.57,19.56 38.57,22.47 39.58,23.48 v39.58,30.42 | 65.48,19.93 64.38,21.04 46.51,21.04 44.73,19.26
  Top 0.305: FTDI.2 65.71,17.94 65.51,18.05 65.48,19.93 | 44.73,19.26 40.14,19.09 39.59,19.66 38.57,19.56
  Bottom 0.254: v39.58,30.42 39.55,30.39 29.01,30.39 v28.99,30.42
FTDI_TX  (via drill 0.35)
  Top 0.254: v26.72,18.89 26.72,17.15 26.24,16.89 U$9.3 | v39.35,38.15 39.19,38.15 39.09,38.05 38.19,38.05 37.85,38.39 37.85,38.56 32.47,38.56 31.92,38.01 30.09,38.01 30.09,35.9 31.78,35.88 v31.91,35.75 | v40.96,37.6 40.99,37.57 v43.3,37.53 v43.31,37.54 | v45.4,38 44.7,38.69 44.7,47.22 47.26,49.79 47.43,49.79 v49.02,51.37 | v24.87,21.83 24.87,22.13 29.5,26.76 v29.5,27.09 | v68.48,21.34 68.48,19.99 70.58,17.89 FTDI.3 | v63.32,70.74 63.89,70.74 63.89,74.53 D1.C
  Bottom 0.254: v26.72,18.89 24.87,20.74 v24.87,21.83 | v40.96,37.6 40.44,38.12 v39.35,38.15 | v43.31,37.54 43.32,37.56 43.53,37.77 45.38,37.77 45.39,37.99 v45.4,38 46.16,37.24 46.16,35.27 45.73,34.84 43.57,34.84 42.59,33.86 42.59,23.75 44.18,22.16 47.66,21.34 v68.48,21.34 | v49.02,51.37 49.08,57.39 63.57,69.11 63.57,70.49 v63.32,70.74 | v31.91,35.75 31.91,34.48 35.21,31.18 39.97,31.18 40.47,30.68 40.47,30.16 39.97,29.66 32.07,29.66 v29.5,27.09
GND  (via drill 0.35)
  Top 0.152: C13.2 89.28,59.22 89.28,54.35 89.74,53.89 90.24,53.89 91.12,54.77 91.12,62.42 90.99,62.56 89.81,62.56 89.61,62.75
  Top 0.2: C25.2 88.03,60.47 C13.2 | Y2.2 88.59,62.33 | 86.78,62.2 C16.1 87.09,62.4 87.86,61.63 88.49,61.63 Y2.2 | Y2.4 90.34,63.48 89.61,62.75 Y2.2
  Top 0.254: U$4.1 U$4.2 | U$7.2 37.13,21.33 | 67.66,29.48 arc-90 C10.2 | C46.2 14.36,34.57 | U4.15 18.73,45.35 18.73,45.03 | C2.2 21.99,50.29 | C1.2 25.78,40.88 | 21.86,30.57 C44.1 | C26.2 arc-90 63.02,68.01 | Y2.4 90.34,65.38 C22.2 90.11,66.72 C12.1 | C20.2 89.15,70.75 C21.2 | 87.04,60.21 C25.2 | U2.EP v79.28,67.12
  Top 0.508: L2.2 91.01,74.29 91.01,72 E1.GND2 E1.GND
  pour Top (rank 6): -11.17,155.68 153.73,155.68 153.73,-7.99 -11.17,-7.99
  pour Bottom (rank 6): -12.54,158.24 156.47,158.24 156.47,-8.89 -12.54,-8.89
GPIO0  (via drill 0.35)
  Top 0.229: U2.23 75.53,65.3 75.35,65.12 v75.35,64.84
  Top 0.254: U$3.3 73.46,45.27 v74.23,46.04 74.89,45.37 U$3.4 | v69.72,55.94 68.14,55.65 v67.25,55.31 | v72.35,67.7 72.02,67.43 70.67,66.08 70.11,66.08 68.92,67.27 66.92,67.27 65.35,68.85 62.31,68.85 61.7,68.24 61.7,65.28 63.04,63.94 R10.2 64.65,65.37 65.13,65.37 v65.15,65.36 | v64.29,59.75 64.7,60.17 64.7,62.93 | 64.7,62.93 | v64.98,63.71 64.7,63.44 64.7,62.93
  Bottom 0.254: v75.35,64.84 75.34,64.95 72.59,67.7 v72.35,67.7 | v74.23,46.04 74.19,46.08 74.19,54.45 72.69,55.95 v69.72,55.94 | v64.29,59.75 64.82,59.22 68.01,59.22 68.01,56.47 67.25,55.71 v67.25,55.31 | v64.98,63.71 64.98,65.19 v65.15,65.36
GPIO2  (via drill 0.35)
  Top 0.229: 74.26,63.01 74.26,65.69 74.26,65.68 U2.22
  Top 0.254: U$4.4 U$4.3 80.98,35 80.98,48.71 76.59,53.1 75.24,53.1 71.37,56.97 71.37,58.32 71.52,58.48 v72.65,58.48 | 74.26,63.01 v75,62.99
  Bottom 0.254: v72.65,58.48 72.59,58.57 72.68,59.95 72.75,60.03 72.85,60.03 72.85,60.84 v75,62.99
GPIO4  (via drill 0.35)
  Top 0.229: U2.24 76.34,64.46 v75.99,64.15
  Top 0.254: U$2.3 U$2.4 41.29,45.17 v43.22,43.24 | v77.06,58.76 77.05,58.74 74.36,58.74 74.16,58.55 74.16,57.68 74.3,57.54 76.29,57.54 78.54,55.29 78.54,52.37 v78.47,52.3 | v75.19,43.73 75.19,41.36 v75.17,41.35
  Bottom 0.254: v43.22,43.24 43.35,43.37 46.75,43.37 50.46,39.66 50.46,33.27 54.63,29.1 62.93,29.1 v75.17,41.35 | v78.47,52.3 75.17,49.01 75.19,48.99 v75.19,43.73 | v75.99,64.15 75.91,64.24 76.48,63.67 76.48,59.34 v77.06,58.76
GPIO5  (via drill 0.35)
  Top 0.229: U2.34 80.75,62.74 81.61,62.13 81.83,61.91 v81.83,61.76
  Top 0.254: v42.22,62.09 43.46,62.09 43.78,61.77 43.85,61.12 v44.3,60.66 | v59.16,71.48 56.75,71.48 56.07,70.8 56.12,67.24 47.26,59.73 v47,59.73
  Bottom 0.254: v59.16,71.48 62.64,74.29 67.26,74.29 67.44,74.29 69.29,74.29 70.09,73.49 70.42,73.49 81.83,62.07 v81.83,61.76 | U$11.A5 33.65,62.31 41.41,62.08 v42.22,62.09 | v44.3,60.66 v47,59.73
GPIO12  (via drill 0.35)
  Top 0.229: U2.18 73.79,67.29 70.49,70.59
  Top 0.254: v40.94,87.46 40.94,83.21 LED5.1 | v45.23,87.39 46.91,85.72 46.91,82.87 50.83,78.94 v56.96,79.12 | 70.49,70.59 70.08,70.59 68.86,71.81 68.86,72.53 68.33,73.07 68.33,73.8 65.24,76.89 65.06,77.07 64.76,77.23 63.98,77.62 63.15,77.62 61.97,78.81 61.97,79.69 v61.88,79.78
  Bottom 0.254: v45.23,87.39 45.16,87.46 v40.94,87.46 | v56.96,79.12 61.21,79.12 v61.88,79.78
GPIO16  (via drill 0.35)
  Top 0.229: U2.25 77.11,61.54 69.64,61.54
  Top 0.254: v38.38,36.13 39.1,35.41 U$1.4 38.38,34.97 v36.69,33.2 | v43.46,35.6 43.18,35.58 v40.99,35.55 | v45.31,35.76 45.31,35.83 46.94,37.46 46.94,40.91 46.14,41.71 46.14,46.1 51.99,51.94 v53.07,51.94 | v69.59,61.59 69.64,61.54 | v34.87,34.49 34.36,34.99 U$1.3 | v60.76,61.19 v57.46,60.96
  Bottom 0.254: v40.99,35.55 40.74,35.55 40.15,36.13 v38.38,36.13 | v45.31,35.76 45.3,35.58 v43.46,35.6 | v53.07,51.94 53.15,57.19 v57.46,60.96 | v69.59,61.59 69.42,61.59 69,61.17 66.64,61.17 66.6,61.16 66.57,61.17 v60.76,61.19 | v34.87,34.49 34.99,34.61 35.28,34.61 v36.69,33.2
GPIO17  (via drill 0.35)
  Top 0.229: U2.27 77.91,63.95 77.89,63.93 77.89,61.32 77.35,60.78 74.26,60.78
  Top 0.254: 74.26,60.78 v74.18,60.86 | v67.59,70.37 65.4,70.37 65.44,70.33 65.1,69.99 62.5,70.02 v62.11,70.65 | v14.48,67.22 15.38,67.22 21.23,73.07 35.87,73.07 v36.38,73.57
  Bottom 0.254: v74.18,60.86 74.18,61.06 75.82,62.7 75.82,63.13 68.93,70.03 67.94,70.03 v67.59,70.37 | U$11.B3 v14.48,67.22 | v36.38,73.57 36.53,73.73 40.49,73.73 42.04,72.18 44.47,70.02 61.26,69.8 v62.11,70.65
GPIO18  (via drill 0.35)
  Top 0.229: U2.35 81.11,64.14 81.11,63.41 81.37,63.15 81.72,63.15 v82.16,62.69
  Top 0.254: v47.63,67.86 47.63,64.68 46.57,63.61 37.05,63.61 v36.92,63.74 | v59.95,68.37 60.09,68.55 v60.06,74.63
  Bottom 0.254: v60.06,74.63 60.44,75 69.67,75 70.37,74.3 70.4,74.3 81.99,62.69 v82.16,62.69 | U$11.A4 35.5,65.15 v36.92,63.74 | v59.95,68.37 58.55,66.97 48.52,66.97 v47.63,67.86
GPIO19  (via drill 0.35)
  Top 0.229: v83.57,63.41 83.57,63.51 83.37,63.71 83.37,64.71 82.9,65.18 82.9,65.32 82.27,65.31 U2.38
  Top 0.254: v76.14,76.43 75.14,77.43 75.14,78.65 72.84,80.96 v72.84,81.8 | v37.22,67.22 38.18,66.26 44.36,66.26 45.04,68.69 46.44,70.09 46.44,71.09 47.06,71.72 48.19,71.72 48.19,72.97 49.66,74.45 49.66,76.31 v50.47,77.13
  Bottom 0.254: v83.57,63.41 83.57,63.7 82.53,64.74 82.53,68.32 76.2,75.45 76.14,75.51 v76.14,76.43 | v37.22,67.22 35.47,69.02 32.95,69.02 U$11.A2 | v72.84,81.8 71.72,80.68 54.25,80.82 53.75,80.65 51.24,78.15 51.45,77.81 v50.47,77.13
GPIO25  (via drill 0.35)
  Top 0.229: U2.14 75.76,68.9 75.72,68.94 74.95,68.94 71,72.7
  Top 0.254: v29.6,61 30.66,59.94 38.07,59.94 38.07,61.66 36.18,63.55 36.18,65.72 36.56,66.1 37.11,66.1 37.75,65.47 44.61,65.47 45.47,66.32 46.14,68.67 46.85,69.38 46.85,70.93 47.23,71.31 48.6,71.31 48.7,71.41 48.7,71.58 48.59,71.69 48.59,72.8 50.7,74.9 v50.7,75.65 51.29,75.65 53.55,78.11 56.14,78.15 56.15,78.17 v57.01,78.17 | 71,72.7 69.9,73.94 68.84,73.94 68.84,76.63 v68.84,76.79
  Bottom 0.254: v57.01,78.17 62.19,78.17 v63.08,79.06 63.13,79.01 71.45,79.01 71.84,78.63 71.84,78.04 71.25,77.46 69.5,77.46 v68.84,76.79 | v50.7,75.65 50.56,75.65 50.52,75.61 v48.1,75.61 | v29.6,61 U$11.A6
HMOSI  (via drill 0.35)
  Top 0.229: v82.15,63.65 81.73,63.63 81.51,63.85 U2.36 | v82.87,61.74 83.22,61.39
  Top 0.254: v36.84,65.45 37.65,64.63 37.78,64.75 44.85,64.75 45.63,65.53 45.73,65.59 46.05,65.91 46.58,67.79 47.5,68.71 v47.5,70.65 | 83.22,61.39 83.22,59.86 84.74,58.34 85.96,58.36 86.28,58.69 v86.28,59.25 | v80.79,77.81 80.66,77.95 80.59,82.36 83.77,85.53 v87.34,85.53
  Bottom 0.254: v82.15,63.65 82.2,63.7 82.24,63.8 82.92,63.01 82.91,61.79 v82.87,61.74 | v80.79,77.81 80.77,77.79 73.7,77.7 71.83,75.99 56.8,76.24 52.03,73.7 v50.43,73.7 49.79,73.07 50.82,71.93 51.06,71.67 51.06,71.22 50.68,70.65 v47.5,70.65 | U$11.A3 35.51,67.28 36.84,65.95 v36.84,65.45 | v87.34,85.53 87.22,85.41 87.22,66.12 86.92,65.83 86.92,59.89 v86.28,59.25
MOSI  (via drill 0.35)
  Top 0.229: U2.20 76.41,66.5 73.08,66.5 71.93,65.35
  Top 0.254: v70.08,63.53 70.06,63.5 68.88,63.5 68.88,58.77 65.01,55.12 v64.77,55.12 | v71.93,65.31 71.93,65.35 | v63.58,53.67 63.28,53.37 63.28,53.11 59.01,48.84 v58.99,46.98 | LCD1.14 55.3,34.58 55.3,37.45 56.44,38.59 58.72,38.59 59.02,38.89 v59.02,44.83
  Bottom 0.254: v71.93,65.31 71.86,65.31 v70.08,63.53 | v64.77,55.12 63.58,53.93 v63.58,53.67 | v59.02,44.83 v58.99,46.98
N$1
  Top 0.254: C3.2 12.23,49.85 Y1.3 17.76,49.85 U4.17
N$2
  Top 0.254: U4.13 19.71,45.39 19.71,45.97 20.04,46.3 21.3,46.3 21.59,46.01 22.21,46.01 22.76,46.56 22.76,48.16 21.08,49.84 21.08,51.01 21.37,51.3 22.61,51.3 23.43,50.49 R3.1
N$3
  Top 0.254: C1.1 23.43,40.88 22.84,41.48 22.84,41.73 22.84,42.05 21.11,42.04 U4.6
N$4
  Top 0.254: C5.1 arc90 19.24,36.86 U4.42
N$5
  Top 0.254: R14.2 30.51,12.59 29.33,12.59 26.94,10.2 26.94,9.36 26.29,8.7 U$6.2
N$6
  Top 0.254: C10.1 66.05,32.79 66.05,35.35 66.04,35.35 63.35,36.87 60.46,36.87 60.2,36.62 LCD1.21
N$7
  Top 0.254: L1.2 16.9,22.52 18.65,20.78 U1.1 18.32,18.59 15.98,16.26 D3.P$2
N$8
  Top 0.254: U4.16 18.25,51.2 19.47,52.42 19.47,52.18 Y1.1 C2.1
N$10  (via drill 0.35)
  Top 0.254: LED14.3 69.64,102.28 67.61,100.25 v67.13,99.09 | v36.32,86.12 32.44,86.12 v32.03,86.53 | v22.19,75.83 18.88,73.48 18.88,72.09 18.87,72.08 18.83,72.04 18.83,71.46 18.25,70.88 16.67,70.88 15.13,72.42 LED1.1
  Bottom 0.254: v67.13,99.09 67.13,97.9 65.45,96.52 65.51,95.75 54.45,84.69 49.34,84.69 45.85,88.19 40.11,88.19 38.05,86.12 v36.32,86.12 | v32.03,86.53 22.71,78.41 v22.19,75.83
N$11
  Top 0.254: U1.3 18.65,15.65 R7.2 18.42,14.53 R6.1 C7.2
N$12
  cutout Top: 98.67,79.49 89.67,79.71 89.33,52.63 98.6,52.36
N$13  (via drill 0.35)
  Top 0.254: LCD1.7 50.44,31.93 v49.54,31.03 | v54.24,55.29 54.24,53.95 R4.2
  Bottom 0.254: v49.54,31.03 49.54,39.25 46.27,42.51 42.97,42.51 42.04,43.43 49.82,51.21 53.44,51.21 53.8,51.56 53.8,52.19 53.72,52.27 53.72,55.15 53.85,55.29 v54.24,55.29
N$14  (via drill 0.35)
  Top 0.254: S1.2 51.25,84.16 49.33,83.6 v49.33,82.28 | U$5.+ v30.15,79.67
  Bottom 0.254: v30.15,79.67 39.47,79.67 41.14,77.99 42.2,77.99 46.54,82.33 49.33,82.33 v49.33,82.28
N$15
  Top 0.229: U2.9 78.31,70.05 78.31,70.53 77.74,71.1 76.55,71.1 76.01,71.63 76.01,71.78 R8.2
N$16
  Top 0.178: Y2.1 88.16,64.08 87.89,64.18 87.89,64.2 C16.2 87.13,64.2 87.43,64.49 87.43,65.61 86.82,65.61 86.27,66.16 86.27,67.21
  Top 0.229: 86.27,67.21 85.36,68.11 U2.45
N$17
  Top 0.178: 89.94,68.83 C12.2 89.96,68.57 | 90.81,68.57 E1.ANT
  Top 0.508: C11.1 90.13,72.81 90.2,69.59 89.94,68.83
  Top 0.61: C12.2 arc90 89.96,68.57 90.81,68.57
N$18
  cutout Bottom: 89.68,82.97 89.68,53.48 102.32,53.48 102.32,82.97
N$19  (via drill 0.35)
  Top 0.254: LED2.1 14.96,96.82 16.03,95.74 16.03,94.63 9.8,88.4 9.8,77.02 11.3,75.53 v14.51,75.53 | v16.16,74.36 16.26,74.26 16.26,72.32 16.75,71.83 LED1.3
  Bottom 0.254: v14.51,75.53 14.99,75.53 v16.16,74.36
N$20  (via drill 0.35)
  Top 0.254: v39.2,37.06 38.94,37.06 38.44,37.57 37.74,37.57 37.38,37.92 32.75,37.92 32.41,37.58 30.61,37.58 30.61,36.49 33.56,36.49 v33.66,36.38 | v40.94,36.64 v43.24,36.61 | v45.42,36.95 45.77,36.95 46.38,37.56 46.38,40.81 45.67,41.51 45.67,46.6 48.09,49.02 48.48,49.02 50.32,50.87 50.32,51.74 50.82,52.24 50.82,52.36 51.33,52.87 v51.86,52.87 | v43.42,28.66 43.42,28.81 v39.75,32.49 | FTDI.4 72.92,19.19 71.52,20.59 | 70.57,24.54 69.14,23.11 v69.14,22.96 | D2.A 52.82,82.46 54.79,80.5 58.05,80.5 63.61,74.94 64.06,74.94 64.29,74.7 64.29,74.37 67.02,71.64 67.14,71.64 v67.5,71.28
  Top 0.305: 71.52,20.59 71.52,23.59 70.57,24.54
  Bottom 0.254: v39.2,37.06 40.51,37.06 v40.94,36.64 | v45.42,36.95 45.41,36.61 v43.24,36.61 | v51.86,52.87 51.79,52.81 51.07,52.81 51.18,57.11 66.86,70.04 66.86,70.64 v67.5,71.28 | v33.66,36.38 33.66,34.1 35.98,31.78 39,31.74 v39.75,32.49 | v43.42,28.66 43.6,24.79 43.6,23.54 44.21,22.93 48.07,22.01 69.6,22.01 69.84,22.26 v69.14,22.96
N$21  (via drill 0.35)
  Top 0.254: LED6.1 v41.1,95.2 | v49.78,86.26 47.77,86.26 47.7,86.19 v47.7,85.26 | LED5.3 43.97,82.46 45.77,84.25 v45.77,85.24
  Bottom 0.254: v49.78,86.26 41.35,94.69 v41.1,95.2 | v47.7,85.26 47.68,85.24 v45.77,85.24
N$22
  Top 0.178: C20.1 87.45,68.73 C19.2 | R9.2 87.49,68.68 C19.2 | 86.32,69.81 87.34,68.83 C19.2
  Top 0.229: 86.32,69.81 83.2,69.81 U2.48
N$23
  Top 0.229: 85.03,70.97 81.56,71.01 81.52,70.97 81.16,70.97 81.11,70.91 U2.2
  Top 0.508: C11.2 L2.1 85.01,74.11 85.03,70.97
N$24
  Top 0.178: Y2.3 90.34,61.71 C13.1 | 85.89,67.03 85.89,65.59 86.18,65.31
  Top 0.2: 86.18,65.31 86.18,64.34 | 86.18,64.34 | 86.18,64.34 86.18,64.04 86.33,63.88 86.33,61.84 86.48,61.7 87.12,61.7 87.94,60.88 89.34,60.88 90.34,59.87 C13.1
  Top 0.229: U2.44 82.73,67.71 85.16,67.71 85.89,67.03
N$25
  Top 0.178: C19.1 87.54,66.99 88.66,66.99 R9.1
  Top 0.229: U2.47 83.09,68.9 83.81,69.43 85.63,69.43 87.54,66.99
N$26  (via drill 0.35)
  Top 0.229: 75.02,72.99 75.02,71.22 76.19,70.05 U2.12
  Top 0.254: 75.02,72.99 74.77,73.25 73.36,73.25 X2.P$2 arc-90 73.23,74.83 v73.23,75.85 | C15.2 78.54,79.88 76.8,78.13 76.8,76.16 76.41,75.77 75.87,75.77 74.72,76.92 v74.38,76.92
  Bottom 0.254: v74.38,76.92 v73.23,75.85
N$27  (via drill 0.35)
  Top 0.229: 73.3,72.36 73.3,71.14 74.52,69.92 75.73,69.92 U2.13
  Top 0.254: 73.3,72.36 X2.P$1 72.09,72.3 70.36,74.03 v71.44,76.66 | v74.58,80.66 C14.1
  Bottom 0.254: v71.44,76.66 v74.58,80.66
N$28
  Top 0.229: 79.18,72.2 79.18,71.86 79.91,71.13 U2.5
  Top 0.254: C18.2 80.31,73.33 79.18,72.2
N$29
  Top 0.229: U2.6 79.51,70.98 78.61,71.88 C18.1
N$30
  Top 0.229: U2.7 79.12,70.04 79.12,70.82 78,71.94 78,72.61
  Top 0.254: C17.2 77.17,73.44 78,72.61
N$31
  Top 0.229: U2.8 78.71,70.03 78.71,70.02 78.71,70.68 77.88,71.51 77.65,71.51 C17.1
N$32  (via drill 0.35)
  Top 0.254: D5.A 35.48,17.58 v33.18,17.58
  Top 0.356: U$6.1 25.72,10.61 v26.98,11.87
  Bottom 0.254: v26.98,11.87 26.73,11.87
  Bottom 0.356: v33.18,17.58 32.5,16.9 27.19,16.9 24.44,14.15 26.73,11.87
N$33
  Top 0.254: LED7.1 42.05,106.33 42.53,105.69 43.75,101.53 46.33,100.62 46.35,100.54 46.33,100.56 47.62,96.46 44.66,93.49 LED6.3
N$34
  Top 0.254: LED8.1 39.39,128.98 38.69,128.28 37.37,127.85 36.89,127.37 37.2,120.02 46.66,112.12 46.91,108.77 46.81,108.76 LED7.3
N$35
  Top 0.254: LED9.1 51.97,101.08 48.03,101.89 47.33,122.06 47.33,126.78 44.14,128.87 LED8.3
N$36
  Top 0.254: LED11.1 53.78,122.51 55.36,120.93 55.36,99.04 56.43,97.96 LED9.3
N$37  (via drill 0.35)
  Top 0.254: v64.3,97.77 64.2,97.87 62.32,97.87 62.32,93.73 LED13.1 | v60.61,102.41 60.61,103.58 57.94,106.25 | 57.94,118.97 57.33,121.06 LED11.3
  Top 0.305: 57.94,106.25 57.82,106.97 59.39,107.63 60.13,109.31 59.57,118.17 57.94,118.97
  Bottom 0.254: v60.61,102.41 64.18,98.84 64.18,97.89 v64.3,97.77
N$38  (via drill 0.35)
  Top 0.254: LED10.1 53.14,111.5 v51.92,112.71 | LED13.3 68.65,92.4 68.44,92.4 68,92.84 68,96.78 66.39,98.39 v65.84,98.39
  Bottom 0.254: v65.84,98.39 65.84,98.31 63.88,96.36 61.42,96.36 60.7,97.07 60.7,97.77 51.79,109.75 51.79,112.59 v51.92,112.71
N$39  (via drill 0.35)
  Top 0.254: LED12.1 63.92,82.83 64.07,85.21 63.59,85.84 v63.59,85.96 | v63.08,97.11 63.08,96.7 v67.13,95.99 | v56.82,104.24 56.54,104.52 56.54,109.79 LED10.3
  Bottom 0.254: v63.08,97.11 63.08,98.43 60.81,100.7 57.68,104.16 v56.82,104.24 | v63.59,85.96 65.94,94.96 66.1,94.96 v67.13,95.99
N$40  (via drill 0.35)
  Top 0.254: v69.2,85.83 70.56,84.47 70.56,80.5 LED12.3 | v69.14,105.95 68.71,105.95 LED14.1
  Bottom 0.254: v69.2,85.83 69.11,105.91 v69.14,105.95
N$41
  Top 0.254: LED2.3 18.27,96.24 24.17,90.34 25.59,90.34 25.7,90.45 26.48,90.45 27.2,89.72 LED3.1
N$42
  Top 0.254: LED3.3 31.27,88.86 31.27,81.32 37.56,75.03 37.56,72.75 38.63,71.69 39.97,71.69 LED4.1
N$43
  Top 0.254: LED16.1 66.89,139.44 68.01,137.31 73.36,134.68 73.44,118.53 LED15.3
N$44
  Top 0.254: LED17.1 75.29,112.16 74.78,135.65 LED16.3
N$45  (via drill 0.35)
  Top 0.254: R15.2 34.8,13.71 33.81,14.7 27.05,14.7 v26.11,13.76 | v29.6,11.74 29.37,11.74 27.66,10.03 27.66,9.19 27.1,8.63 U$6.3 | U$6.3
  Bottom 0.254: v26.11,13.76 27.18,12.69 28.66,12.69 v29.6,11.74
N$46  (via drill 0.35)
  Top 0.254: LED18.1 92.49,113.09 94.4,111.18 89.46,106.24 v88.7,106.46 | LED17.3 v85.4,107.35
  Bottom 0.254: v85.4,107.35 v88.7,106.46
N$47  (via drill 0.35)
  Top 0.305: v14.48,58.97 12.2,61.25 v12.2,63.29
  Bottom 0.254: v12.2,63.29 11.94,63.54
  Bottom 0.406: JP1.1 23.68,110.3 23.59,80.05
  Bottom 0.508: 11.94,63.54 11.94,79.54 12.45,80.05 23.59,80.05
  Bottom 0.61: U$11.B8 14.99,57.15 14.48,57.66 v14.48,58.97
N$48  (via drill 0.35)
  Top 0.254: C41.2 12.38,96.92 14.29,98.83 14.32,98.83 21.07,92.07 21.07,92.06 23.36,89.77 25.16,89.77 C42.2 26.11,88.82 28.2,88.82 28.99,89.61 28.99,90.12 28.01,91.1 26.18,91.1 25.94,91.34 v26.05,91.45 | v41.67,78.9 41.1,78.9 39.66,77.46 39.66,74.12 39.65,74.12 v39.65,72.99 | C38.2 63.68,79.91 60.67,82.92 v59.53,82.92 | C37.2 38.62,130.18 39.21,130.35 44.55,132.07 v47.13,134.65 | v61.77,102.64 63.55,102.64 C39.2 60.84,101.68 v58.45,99.29 | 62.23,92.15 61.38,93.24 v60.89,93.73 | C41.2 12.38,96.04 | C40.2 12.56,72.5 8.39,76.67 8.39,92.09 8.41,92.07 8.79,92.45 v8.79,92.54 | 62.23,92.15 C36.2 | v62.79,91.22 62.23,92.15 | C43.2 38.48,70.52 v35.49,70.52 | v8.79,96.12 12.24,96.12 C41.2
  Bottom 0.254: v26.05,91.45 29.26,91.45 37.67,83.03 41.81,83.03 41.81,82.94 42.16,82.94 | 42.16,82.94 42.16,84.21 58.62,84.21 | 42.16,82.94 42.16,79.64 41.54,79.03 v41.67,78.9 | v59.53,82.92 59.53,83.3 58.62,84.21 | v60.89,93.73 60.02,97.72 v58.45,99.29 | v61.77,102.64 61.77,112.13 44.82,129.08 44.82,132.34 v47.13,134.65 | 58.62,84.21 v62.79,91.22 | v39.65,72.99 37.5,71.23 v35.49,70.52 | v8.79,92.54 v8.79,96.12
N$49  (1 unrouted)
N$50  (via drill 0.35)
  other vias: 90.18,78.94
N$51
  Top 0.254: LED18.3 95.79,112.89 95.79,121.8 92.48,125.11 LED19.1
N$52
  pour Top: 77.47,116.1 77.31,116.04 77.32,116.01 77.33,115.97 77.34,115.93 77.35,115.9 77.36,115.86 77.37,115.83 77.38,115.79 77.39,115.75 77.45,115.77 77.5,115.79 77.56,115.82 77.62,115.84 77.68,115.86 77.73,115.88 77.79,115.9 77.85,115.92 77.93,115.95 77.98,115.96 78.02,115.98 78.06,115.98 78.1,115.99 78.19,116 78.4,115.95 78.61,115.91 78.78,115.78 78.95,115.66 79.06,115.47 79.17,115.29 79.22,115.07 79.26,114.85 79.26,114.35 79.52,114.35 79.52,115.75 79.55,115.93 79.58,116.11 79.65,116.26 79.73,116.41 79.84,116.54 79.96,116.66 80.1,116.74 80.25,116.83 80.4,116.89 80.56,116.95 80.87,117.07 81.03,117.14 81.19,117.2 81.35,117.26 81.5,117.32 81.49,117.36 81.48,117.39 81.47,117.43 81.46,117.47 81.46,117.5 81.45,117.54 81.44,117.57 81.43,117.61 81.37,117.59 81.31,117.57 81.26,117.55 81.2,117.53 81.14,117.51 81.08,117.49 81.03,117.47 80.97,117.45 80.88,117.41 80.84,117.4 80.8,117.39 80.76,117.38 80.71,117.37 80.63,117.36 80.42,117.41 80.22,117.45 80.05,117.57 79.88,117.69 79.76,117.86 79.65,118.04 79.6,118.26 79.56,118.48 79.56,119.01 79.29,119.01 79.29,117.61 79.27,117.43 79.24,117.25 79.16,117.09 79.08,116.93 78.96,116.8 78.84,116.67 78.69,116.58 78.53,116.5 78.38,116.44 78.23,116.38 78.08,116.33 77.92,116.27 77.77,116.21 77.62,116.16
N$53
  Top 0.254: U$10.2 13.54,29.73 10.86,32.41 R2.2
N$54
  Top 0.254: U$10.3 12.83,29.08 11.64,30.27 10.86,30.27 R11.2
N$55
  pour Top: 67.25,128.98 67.1,128.93 67.11,128.89 67.12,128.86 67.13,128.82 67.14,128.78 67.15,128.75 67.16,128.71 67.18,128.64 67.23,128.66 67.29,128.68 67.35,128.7 67.4,128.72 67.46,128.74 67.52,128.76 67.58,128.78 67.63,128.8 67.72,128.83 67.76,128.85 67.8,128.86 67.89,128.88 67.98,128.89 68.19,128.84 68.4,128.79 68.57,128.67 68.74,128.54 68.85,128.36 68.96,128.17 69.04,127.73 69.04,127.24 69.31,127.24 69.31,128.64 69.34,128.82 69.36,128.99 69.44,129.15 69.51,129.3 69.74,129.54 70.03,129.71 70.19,129.77 70.35,129.84 70.5,129.9 70.66,129.96 70.82,130.02 71.13,130.14 71.29,130.21 71.28,130.24 71.27,130.28 71.25,130.35 71.24,130.39 71.23,130.42 71.22,130.46 71.21,130.5 71.16,130.47 71.1,130.45 71.04,130.43 70.98,130.41 70.93,130.39 70.87,130.37 70.81,130.35 70.76,130.33 70.71,130.32 70.67,130.3 70.63,130.29 70.58,130.27 70.54,130.26 70.5,130.25 70.46,130.25 70.41,130.25 70.21,130.29 69.94,130.35 69.84,130.45 69.67,130.57 69.55,130.75 69.43,130.93 69.39,131.14 69.35,131.36 69.35,131.9 69.08,131.9 69.08,130.5 69.05,130.32 69.03,130.14 68.95,129.98 68.87,129.81 68.75,129.69 68.63,129.56 68.47,129.47 68.32,129.38 68.17,129.32 68.01,129.27 67.86,129.21 67.71,129.15 67.56,129.1 67.4,129.04
N$56
  pour Top: 82.7,128 82.55,127.95 82.56,127.91 82.57,127.87 82.58,127.84 82.59,127.8 82.6,127.77 82.61,127.73 82.62,127.69 82.63,127.66 82.68,127.68 82.74,127.7 82.8,127.72 82.85,127.74 82.91,127.76 82.97,127.78 83.03,127.8 83.08,127.82 83.13,127.84 83.17,127.85 83.21,127.87 83.25,127.88 83.34,127.9 83.38,127.9 83.43,127.91 83.64,127.86 83.85,127.81 84.02,127.69 84.19,127.56 84.3,127.38 84.41,127.19 84.45,126.97 84.49,126.75 84.49,126.26 84.76,126.26 84.76,127.66 84.79,127.83 84.81,128.01 84.89,128.17 84.96,128.32 85.08,128.44 85.19,128.56 85.34,128.65 85.48,128.73 85.64,128.79 85.8,128.85 85.95,128.92 86.11,128.98 86.27,129.04 86.42,129.1 86.58,129.16 86.74,129.23 86.73,129.26 86.72,129.3 86.71,129.33 86.7,129.37 86.69,129.41 86.68,129.44 86.66,129.52 86.6,129.49 86.55,129.47 86.49,129.45 86.43,129.43 86.38,129.41 86.32,129.39 86.26,129.37 86.21,129.35 86.12,129.32 86.08,129.31 86.03,129.29 85.95,129.27 85.91,129.27 85.86,129.27 85.66,129.31 85.45,129.35 85.28,129.47 85.12,129.59 85,129.77 84.88,129.95 84.84,130.16 84.8,130.38 84.8,130.92 84.53,130.92 84.53,129.52 84.5,129.34 84.47,129.16 84.4,128.99 84.32,128.83 84.2,128.7 84.08,128.58 83.92,128.49 83.77,128.4 83.62,128.34 83.46,128.29 83.31,128.23 83.16,128.17 83.01,128.12 82.85,128.06
N$57  (via drill 0.35)
  other vias: 87.99,76.92
N$58
  Top 0.254: R12.2 13.82,32.49 U$10.1
N$59  (via drill 0.35)
  other vias: 87.99,75.82
N$60
  Top 0.254: U$10.4 13.62,28.22 11.43,28.22 11.13,27.93 11.07,27.93 R13.1
N$61  (via drill 0.35)
  other vias: 89.07,75.87
N$62  (via drill 0.35)
  other vias: 89.09,76.93
N$63  (via drill 0.35)
  other vias: 89.01,78.97
N$64  (via drill 0.35)
  other vias: 89.05,78
N$65  (via drill 0.35)
  other vias: 88.01,79
N$66  (via drill 0.35)
  other vias: 88,78.02
N$67  (via drill 0.35)
  other vias: 90.12,77.95
N$68  (via drill 0.35)
  other vias: 90.12,76.93
N$69  (via drill 0.35)
  other vias: 90.17,75.83
N$70  (via drill 0.35)
  other vias: 89.89,58.75
N$71  (via drill 0.35)
  other vias: 89.94,57.73
N$72  (via drill 0.35)
  other vias: 89.94,56.66
N$73  (via drill 0.35)
  other vias: 89.98,55.54
N$74  (via drill 0.35)
  other vias: 89.99,54.5
N$75  (via drill 0.35)
  other vias: 88.53,58.71
N$76  (via drill 0.35)
  other vias: 88.56,57.78
N$77  (via drill 0.35)
  other vias: 88.59,56.65
N$78  (via drill 0.35)
  other vias: 88.61,55.56
N$79  (via drill 0.35)
  other vias: 88.61,54.54
N$80  (via drill 0.35)
  other vias: 87.18,58.81
N$81  (via drill 0.35)
  other vias: 87.21,57.77
N$82  (via drill 0.35)
  other vias: 87.23,56.68
N$83  (via drill 0.35)
  other vias: 87.21,55.61
N$84  (via drill 0.35)
  other vias: 87.23,54.58
N$85
  pour Top: 21.37,119.64 21.22,119.58 21.23,119.54 21.24,119.51 21.25,119.47 21.26,119.43 21.27,119.4 21.27,119.36 21.28,119.33 21.29,119.29 21.35,119.31 21.41,119.33 21.47,119.35 21.52,119.37 21.58,119.39 21.64,119.41 21.69,119.43 21.75,119.45 21.79,119.47 21.84,119.48 21.88,119.5 21.92,119.51 22.01,119.53 22.05,119.53 22.09,119.54 22.31,119.49 22.52,119.44 22.69,119.32 22.86,119.19 22.97,119.01 23.08,118.82 23.12,118.6 23.16,118.38 23.16,117.89 23.43,117.89 23.43,119.29 23.45,119.47 23.48,119.64 23.56,119.8 23.63,119.95 23.86,120.19 24.01,120.28 24.15,120.36 24.31,120.42 24.46,120.49 24.62,120.55 24.78,120.61 24.94,120.67 25.09,120.73 25.25,120.8 25.41,120.86 25.4,120.89 25.39,120.93 25.38,120.97 25.37,121 25.36,121.04 25.35,121.07 25.34,121.11 25.33,121.15 25.27,121.13 25.22,121.11 25.16,121.08 25.1,121.06 25.04,121.04 24.99,121.02 24.93,121 24.87,120.98 24.83,120.97 24.79,120.95 24.75,120.94 24.7,120.92 24.62,120.91 24.57,120.9 24.53,120.9 24.33,120.94 24.12,120.99 23.95,121.1 23.78,121.22 23.67,121.4 23.55,121.58 23.51,121.8 23.46,122.01 23.46,122.55 23.2,122.55 23.2,121.15 23.17,120.97 23.14,120.79 23.07,120.63 22.99,120.47 22.87,120.34 22.75,120.21 22.59,120.12 22.44,120.03 22.28,119.98 22.13,119.92 21.98,119.86 21.83,119.81 21.67,119.75 21.52,119.69
N$86